# EAGLE design main (EAGLE 6.1)
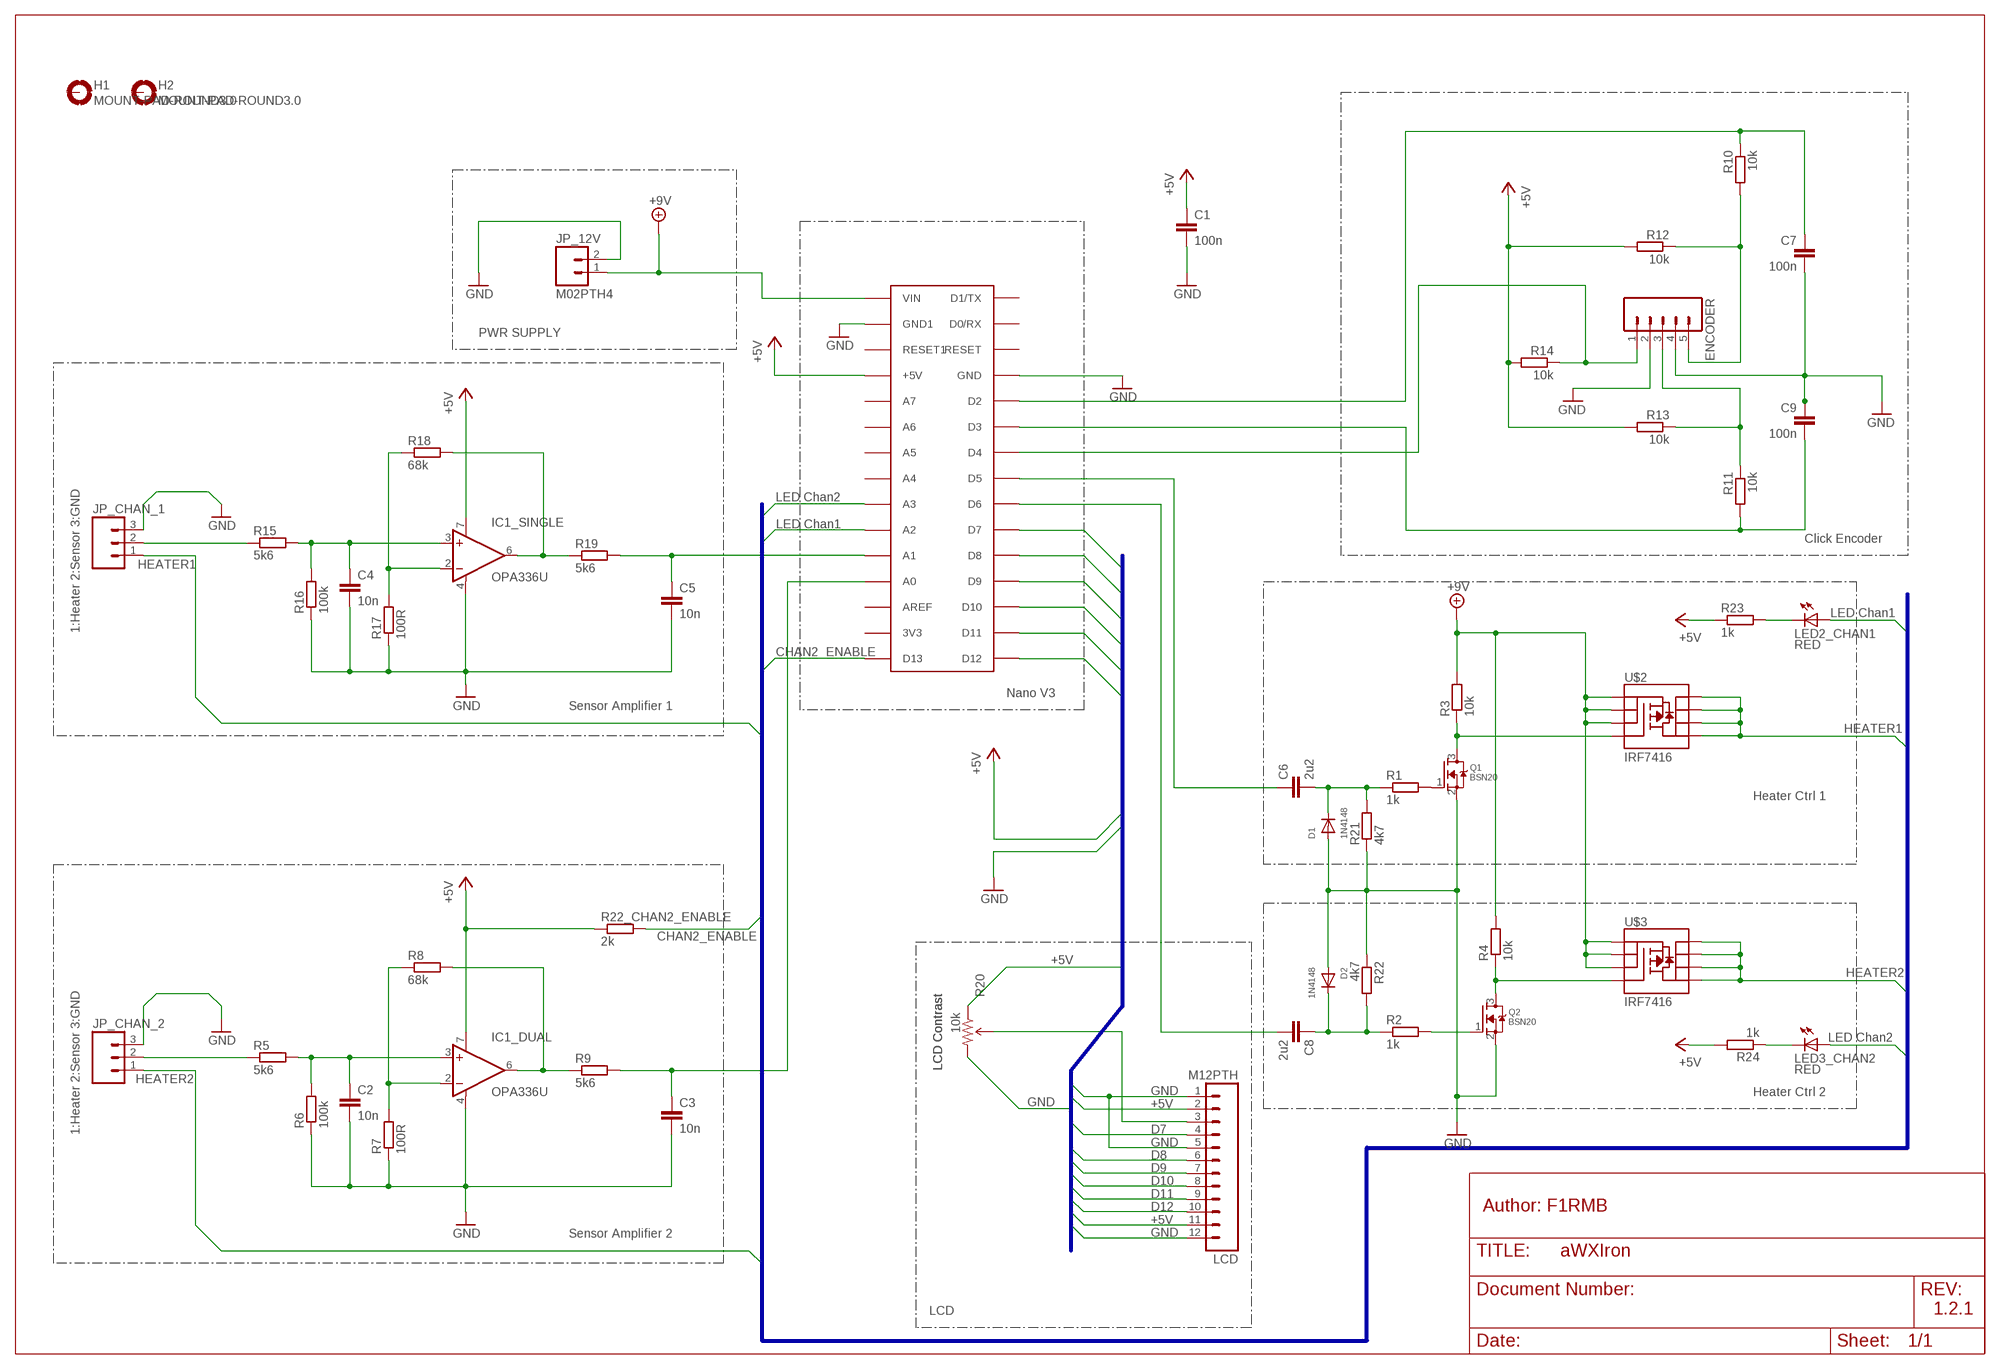
[diagram p0: schematic, sheet 1]
FRAME1 (DINA3_L): DRAWING_NAME: aWXIron

## Parts
C1  100n  C-EUC0805  [C0805]
C2  10n  C-EUC0805  [C0805]
C3  10n  C-EUC0805  [C0805]
C4  10n  C-EUC0805  [C0805]
C5  10n  C-EUC0805  [C0805]
C6  2u2  C-EUC0805  [C0805]
C7  100n  C-EUC0805  [C0805]
C8  2u2  C-EUC0805  [C0805]
C9  100n  C-EUC0805  [C0805]
D1  1N4148  DIODESOD-123  [SOD-123]
D2  1N4148  DIODESOD-123  [SOD-123]
ENCODER  M05PTH  [1X05]
H1  MOUNT-PAD-ROUND3.0  [3,0-PAD]
H2  MOUNT-PAD-ROUND3.0  [3,0-PAD]
IC1_DUAL  OPA336U  [SO08]
IC1_SINGLE  OPA336U  [SO08]
JP_12V  M02PTH4  [1X02_XTRA_BIG]
JP_CHAN_1  M03SCREW  [SCREWTERMINAL-3.5MM-3]
JP_CHAN_2  M03SCREW  [SCREWTERMINAL-3.5MM-3]
LCD  M12PTH  [1X12]
LED2_CHAN1  RED  LED3MM  [LED3MM]
LED3_CHAN2  RED  LED3MM  [LED3MM]
Q1  BSN20  MOSFET-NREFLOW  [SOT23]
Q2  BSN20  MOSFET-NREFLOW  [SOT23]
R1  1k  R-EU_R0805  [R0805]
R2  1k  R-EU_R0805  [R0805]
R3  10k  R-EU_R0805  [R0805]
R4  10k  R-EU_R0805  [R0805]
R5  5k6  R-EU_R0805  [R0805]
R6  100k  R-EU_R0805  [R0805]
R7  100R  R-EU_R0805  [R0805]
R8  68k  R-EU_R0805  [R0805]
R9  5k6  R-EU_R0805  [R0805]
R10  10k  R-EU_R0805  [R0805]
R11  10k  R-EU_R0805  [R0805]
R12  10k  R-EU_R0805  [R0805]
R13  10k  R-EU_R0805  [R0805]
R14  10k  R-EU_R0805  [R0805]
R15  5k6  R-EU_R0805  [R0805]
R16  100k  R-EU_R0805  [R0805]
R17  100R  R-EU_R0805  [R0805]
R18  68k  R-EU_R0805  [R0805]
R19  5k6  R-EU_R0805  [R0805]
R20  10k  TRIMPOT3362U-2  [3362U-2]
R21  4k7  R-EU_R0805  [R0805]
R22  4k7  R-EU_R0805  [R0805]
R22_CHAN2_ENABLE  2k  R-EU_R0805  [R0805]
R23  1k  R-EU_R0805  [R0805]
R24  1k  R-EU_R0805  [R0805]
U$1  ARDUINONANO  [PDIP-32]
U$2  IRF7416  MOSFET-PCHANNEL-SOIC8SOIC8  [SO08]
U$3  IRF7416  MOSFET-PCHANNEL-SOIC8SOIC8  [SO08]

## Nets
+5V: C1.1 IC1_DUAL.7(V+) IC1_SINGLE.7(V+) LCD.2 LCD.11 R12.2 R13.2 R14.2 R20.1(CCW) R22_CHAN2_ENABLE.1 R23.1 R24.2 U$1.+5V
+9V: JP_12V.1 R3.2 R4.2 U$1.VIN U$2.1(S) U$2.2(S) U$2.3(S) U$3.1(S) U$3.2(S) U$3.3(S)
DB4: LCD.7 U$1.D9
DB5: LCD.8 U$1.D10
DB6: LCD.9 U$1.D11
DB7: LCD.10 U$1.D12
E: LCD.6 U$1.D8
ENABLECHAN2: R22_CHAN2_ENABLE.2 U$1.D13
GND: C1.2 C2.2 C3.2 C4.2 C5.2 C7.2 C9.1 D1.A D2.A ENCODER.2 ENCODER.4 IC1_DUAL.4(V-) IC1_SINGLE.4(V-) JP_12V.2 JP_CHAN_1.3 JP_CHAN_2.3 LCD.1 LCD.5 LCD.12 Q1.2(S) Q2.2(S) R6.1 R7.1 R16.1 R17.1 R20.3(CW) R21.1 R22.1 U$1.GND U$1.GND1
HEATCHAN1: LED2_CHAN1.A U$1.A2
HEATCHAN2: LED3_CHAN2.A U$1.A3
HEATER1: JP_CHAN_1.1 U$2.5(D) U$2.6(D) U$2.7(D) U$2.8(D)
HEATER2: JP_CHAN_2.1 U$3.5(D) U$3.6(D) U$3.7(D) U$3.8(D)
N$1: Q1.3(D) R3.1 U$2.4(G)
N$2: Q2.3(D) R4.1 U$3.4(G)
N$3: JP_CHAN_2.2 R5.1
N$4: C2.1 IC1_DUAL.3(+IN) R5.2 R6.2
N$5: IC1_DUAL.2(-IN) R7.2 R8.1
N$6: C7.1 R10.1 U$1.D2
N$7: IC1_DUAL.6(OUT) R8.2 R9.1
N$8: JP_CHAN_1.2 R15.1
N$9: C4.1 IC1_SINGLE.3(+IN) R15.2 R16.2
N$10: C6.1 U$1.D5
N$11: C8.2 U$1.D6
N$12: Q1.1(G) R1.2
N$13: Q2.1(G) R2.2
N$14: C3.1 R9.2 U$1.A0
N$15: ENCODER.5 R10.2 R12.1
N$16: LCD.3 R20.2(WIPER)
N$17: C6.2 D1.C R1.1 R21.2
N$18: ENCODER.3 R11.1 R13.1
N$19: C9.2 R11.2 U$1.D3
N$20: IC1_SINGLE.2(-IN) R17.2 R18.1
N$21: IC1_SINGLE.6(OUT) R18.2 R19.1
N$22: ENCODER.1 R14.1 U$1.D4
N$23: C5.1 R19.2 U$1.A1
N$24: C8.1 D2.C R2.1 R22.2
N$27: LED2_CHAN1.K(C) R23.2
N$28: LED3_CHAN2.K(C) R24.1
RS: LCD.4 U$1.D7
Unconnected: H1.B3,0(MOUNT) H2.B3,0(MOUNT) U$1.3V3 U$1.A4 U$1.A5 U$1.A6 U$1.A7 U$1.AREF U$1.D0/RX U$1.D1/TX U$1.RESET U$1.RESET1

## Buses
+5V,GND,RS,E,DB4,DB5,DB6,DB7
HEATCHAN1,HEATCHAN2,ENABLECHAN2,HEATER1,HEATER2

## Notes on the sheet
- PWR SUPPLY
- LED Chan2
- LED Chan1
- Click Encoder
- HEATER1
- LED Chan1
- 1:Heater 2:Sensor 3:GND
- CHAN2_ENABLE
- Nano V3
- Sensor Amplifier 1
- HEATER1
- Heater Ctrl 1
- CHAN2_ENABLE
- +5V
- HEATER2
- LED Chan2
- LCD Contrast | LCD Contrast
- HEATER2
- GND | Heater Ctrl 2
- GND | +5V
- 1:Heater 2:Sensor 3:GND | D7
- GND
- D8
- D9
- D10
- D11
- D12 | Author: F1RMB
- +5V
- Sensor Amplifier 2 | GND
- LCD | 1.2.1

## Library data of the parts
C1-C9 = resistor:C-EU: CAPACITOR, European symbol
D1 D2 = adafruit:DIODE: Diode SMADIODE - SMA Surface Mount Package 20V 1A Schottky Diode Digikey: 641-1014-6-ND DO-1N4148 - Through Hole Small Current Diode SOD-123 20V 1 A (.5mV Vf) Schottky Diode - Digikey: MBRX120TPMSCT-ND SOD-323 10V 570mA (.38mV Vf, 3ns) Schottky Diode - Digikey: ZLLS410CT-ND SOD-523 30V 30mA Schottky Diode (RB751S-40TE61) - Digikey: RB751S-40TE61CT-ND SOT23-R/W - SOT23 Package (R = Solder Paste/Reflow Ovens, W = Hand-Soldering) BAT54Film 40V 300mA - Digikey: 497-7162-1-ND
ENCODER = SparkFun-Connectors:M05: Header 5 Standard 5-pin 0.1" header. Use with straight break away headers (SKU : PRT-00116), right angle break away headers (PRT-00553), swiss pins (PRT-00743), machine pins (PRT-00117), and female headers (PRT-00115). Molex polarized connector foot print use with SKU : PRT-08230 with associated crimp pins and housings.
H1 H2 = holes:MOUNT-PAD-ROUND: MOUNTING PAD, round
IC1_DUAL IC1_SINGLE = burr-brown:OPA336: CMOS Operational Amplifiers Single-Supply, MicroPower, MicroAmplifier(TM) Series; MF: TEXAS INSTRUMENT CONNECTORS; MPN: OPA336UA; OC_FARNELL: 1459587; OC_NEWARK: 35C1888
JP_12V = SparkFun-Connectors:M02: Standard 2-pin 0.1" header. Use with - straight break away headers ( PRT-00116) - right angle break away headers (PRT-00553) - swiss pins (PRT-00743) - machine pins (PRT-00117) - female headers (PRT-00115) Molex polarized connector foot print use with: PRT-08233 with associated crimp pins and housings. 2.54_SCREWTERM for use with PRT-10571. 3.5mm Screw Terminal footprints for PRT-08084 5mm Screw Terminal footprints for use with PRT-08433
JP_CHAN_1 JP_CHAN_2 = SparkFun-Connectors:M03: Header 3 Standard 3-pin 0.1" header. Use with straight break away headers (SKU : PRT-00116), right angle break away headers (PRT-00553), swiss pins (PRT-00743), machine pins (PRT-00117), and female headers (PRT-00115). Molex polarized connector foot print use with SKU : PRT-08232 with associated crimp pins and housings.
LCD = SparkFun-Connectors:M12: Header 12 Standard 12-pin 0.1" header. Use with straight break away headers (SKU : PRT-00116), right angle break away headers (PRT-00553), swiss pins (PRT-00743), machine pins (PRT-00117), and female headers (PRT-00115).
LED2_CHAN1 LED3_CHAN2 = SparkFun-LED:LED: LEDs Standard schematic elements and footprints for 5mm, 3mm, 1206, and 0603 sized LEDs. 5mm - Spark Fun Electronics SKU : COM-00529 (and others)
Q1 Q2 = adafruit:MOSFET-N: N-Channel Mosfet 2N7002E - 60V 260mA SOT23 [Digikey: 2N7002ET1GOSTR-ND] - REEL BSH103 - 30V 850mA SOT23 [Digikey: 568-5013-1-ND]
R1-R19 R21 R22 R22_CHAN2_ENABLE R23 R24 = resistor:R-EU_: RESISTOR, European symbol
R20 = SparkFun-Electromechanical:TRIMPOT: Various small potentiometers for "set-and-forget" applications
U$1 = jet-lib:ARDUINONANO
U$2 U$3 = SparkFun-DiscreteSemi:MOSFET-PCHANNEL-SOIC8: Generic 8-pin PMOSFET

## Board
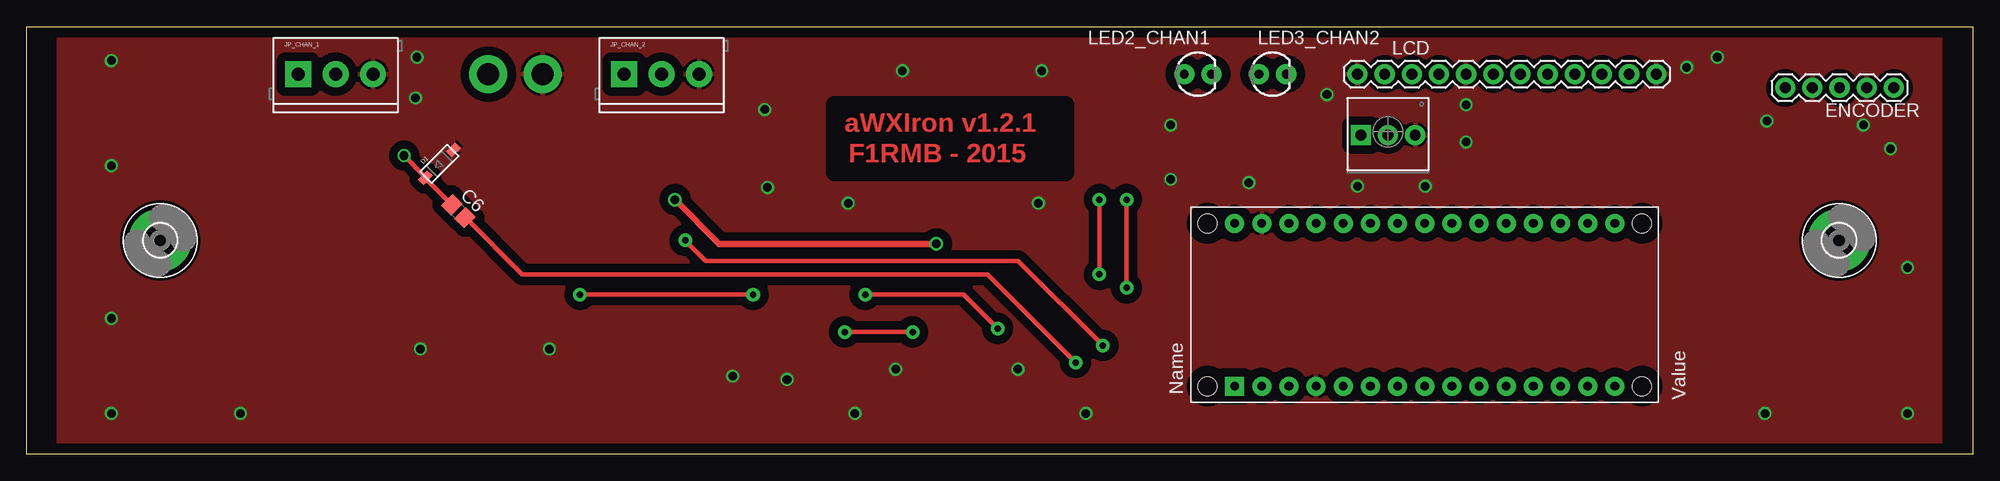
[diagram p1: board, top side]
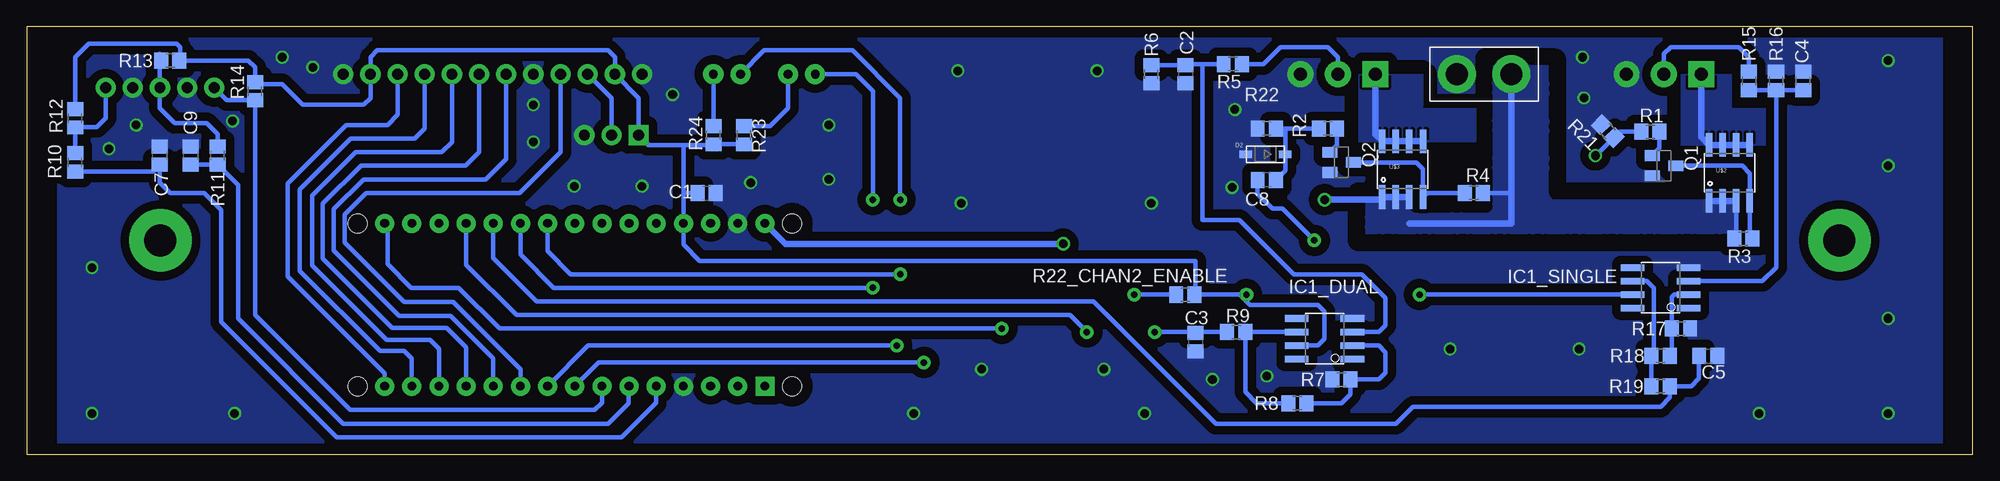
[diagram p2: board, bottom side, seen from below]

Size 181.98 x 40 mm. Coordinates in mm from the lower left corner, seen from the top.
Outline: 181.98,0 0,0 0,40 181.98,40 181.98,0
Copper layers (1*16): Top 0.035mm / dielectric 1.5mm / Bottom 0.035mm
Design rules: minimum track width 10mil, minimum drill 24mil, track to track 8mil, track to pad 8mil, pad to pad 8mil, via to via 8mil, smd to smd 8mil, copper to edge 40mil, drill to drill 8mil, minimum pad ring 10mil, minimum via ring 8mil, stop-mask expansion 4mil, vias tented up to drill 0mil, thermal gap 10mil
tRestrict: area 0,0 to 2,40; area 180,0 to 182,40; area 75.5,26.4 to 97.1,32.7
bRestrict: area 0,0 to 2,40; area 180,0 to 182,40; 114 lines

### Footprints (pad centres in the part's own frame; a part is rotated, then mirrored left to right if it is on the bottom)
C0805 = smd 1.3 x 1.5: 1 -0.85,0; 2 0.85,0
SOD-123 = smd 1.2 x 0.7: A 1.85,0; C -1.85,0
1X05 = drill 1.016 pad 1.88: 1 0,0; 2 2.54,0; 3 5.08,0; 4 7.62,0; 5 10.16,0
3,0-PAD = drill 3 pad 5.842: B3,0 0,0
SO08 = smd 0.61 x 2.21: 1 -1.905,-2.616; 2 -0.635,-2.616; 3 0.635,-2.616; 4 1.905,-2.616; 5 1.905,2.616; 6 0.635,2.616; 7 -0.635,2.616; 8 -1.905,2.616
1X02_XTRA_BIG = drill 2.057 pad 3.556: 1 -2.54,0; 2 2.54,0
SCREWTERMINAL-3.5MM-3 = drill 1.2 pad 2.413 square: 1 0,0 | drill 1.2 pad 2.413: 2 3.5,0; 3 7,0
1X12 = drill 1.016 pad 1.88: 1 0,0; 2 2.54,0; 3 5.08,0; 4 7.62,0; 5 10.16,0; 6 12.7,0; 7 15.24,0; 8 17.78,0; 9 20.32,0; 10 22.86,0; 11 25.4,0; 12 27.94,0
LED3MM = drill 0.813 pad 1.88: A -1.27,0; K 1.27,0
SOT23 = smd 1 x 1.4: 1 -0.95,-1.1; 2 0.95,-1.1; 3 0,1.1
R0805 = smd 1.3 x 1.5: 1 -0.85,0; 2 0.85,0
3362U-2 = drill 1.016 pad 1.88 square: 1 -2.54,-0.305 | drill 1.016 pad 1.88: 2 0,-0.305; 3 2.54,-0.305
PDIP-32 = drill 0.8 pad 1.778: 3V3 15.24,-35.56; +5V 15.24,-10.16; A0 15.24,-30.48; A1 15.24,-27.94; A2 15.24,-25.4; A3 15.24,-22.86; A4 15.24,-20.32; A5 15.24,-17.78; A6 15.24,-15.24; A7 15.24,-12.7; AREF 15.24,-33.02; D0/RX 0,-5.08; D2 0,-12.7; D3 0,-15.24; D4 0,-17.78; D5 0,-20.32; D6 0,-22.86; D7 0,-25.4; D8 0,-27.94; D9 0,-30.48; D10 0,-33.02; D11 0,-35.56; D12 0,-38.1; D13 15.24,-38.1; GND 0,-10.16; GND1 15.24,-5.08; RESET 0,-7.62; RESET1 15.24,-7.62; VIN 15.24,-2.54 | drill 0.8 pad 1.778 square: D1/TX 0,-2.54 | hole 1.778: 0,0; 0,-40.64; 15.24,-40.64; 15.24,0

### Placement (x,y rotation side)
C1  118.41,24.45 0 bottom
C2  73.64,35.56 270 bottom
C3  72.69,10.48 270 bottom
C4  15.86,34.92 90 bottom
C5  24.75,9.21 0 bottom
C6  40.37,22.73 135 top
C7  169.52,27.94 90 bottom
C8  66.02,25.65 180 bottom
C9  166.67,27.94 270 bottom
D1  38.59,27.18 45 top
D2  66.15,28.07 180 bottom
ENCODER  164.44,34.29 0 top
H1  169.48,20 0 top
H2  12.48,20 0 top
IC1_DUAL  60.62,10.79 90 bottom
IC1_SINGLE  29.19,15.56 90 bottom
JP_12V  45.7,35.56 180 bottom
JP_CHAN_1  25.38,35.56 0 top
JP_CHAN_2  55.86,35.56 0 top
LCD  124.44,35.56 0 top
LED2_CHAN1  109.52,35.56 0 top
LED3_CHAN2  116.5,35.56 0 top
Q1  28.87,26.99 270 bottom
Q2  59.03,27.3 270 bottom
R1  30.14,30.16 0 bottom
R2  60.3,30.48 0 bottom
R3  21.46,20.17 180 bottom
R4  46.65,24.45 0 bottom
R5  69.2,36.51 180 bottom
R6  76.81,35.56 90 bottom
R7  59.03,6.99 0 bottom
R8  63.16,4.76 180 bottom
R9  68.88,11.43 180 bottom
R10  177.46,27.3 90 bottom
R11  164.13,27.94 270 bottom
R12  177.46,31.43 90 bottom
R13  168.57,36.83 0 bottom
R14  160.63,33.97 90 bottom
R15  20.93,34.92 270 bottom
R16  18.39,34.92 270 bottom
R17  27.29,11.75 180 bottom
R18  29.19,9.21 180 bottom
R19  29.19,6.35 0 bottom
R20  127.3,30.16 0 top
R21  34.14,30.23 315 bottom
R22  66.02,30.48 0 bottom
R22_CHAN2_ENABLE  73.64,14.92 180 bottom
R23  114.92,29.84 90 bottom
R24  117.77,29.84 270 bottom
U$1  110.41,6.35 90 top
U$2  22.76,26.32 0 bottom
U$3  53.32,26.67 0 bottom

### Tracks (layer width: path | path; a pad name or v marks a point on that pad's centre or on a via)
+5V  (via drill 0.6 pad 1.27)
  Top 0.406: v51.73,14.92 v67.92,14.92
  Bottom 0.406: U$1.+5V 120.57,28.94 | 120.57,28.94 117.83,28.94 R24.2 R23.1 | U$1.+5V 120.57,19.63 119.04,18.1 72.69,18.1 72.69,14.82 R22_CHAN2_ENABLE.1 68.56,14.92 | R12.2 177.46,37.15 176.19,38.42 167.94,38.42 167.62,38.1 167.62,37.57 R13.2 161.27,36.83 160.63,36.2 R14.2 160.42,34.61 158.09,34.61 156.19,32.7 150.47,32.7 149.84,33.34 LCD.11 149.84,37.15 149.2,37.78 127.62,37.78 126.98,37.15 LCD.2 124.76,33.34 R20.1 123.9,29 123.9,28.94 120.57,28.94 | IC1_SINGLE.7 v51.73,14.92 | v67.92,14.92 68.56,14.92 | IC1_DUAL.7 61.26,10.16 60.62,10.79 60.62,13.34 61.26,13.97 67.61,13.97 68.56,14.92 | C1.1 120.57,24.45 U$1.+5V
+9V  (via drill 0.8 pad 1.27)
  Top 0.61: v60.62,23.81 64.75,19.68 v85.07,19.68
  Bottom 0.406: R3.2 arc-90 22.13,19.71 U$2.3 | 49.19,21.59 50.14,21.59 | R4.2 43.16,24.45
  Bottom 0.61: U$3.3 U$3.2 U$3.1 | U$2.1 U$2.2 U$2.3 | JP_12V.1 43.16,24.51 43.16,24.45 43.16,21.59 50.14,21.59 52.68,21.59 | U$1.VIN 111.04,19.68 v85.07,19.68 | 55.47,23.81 v60.62,23.81
  pour Bottom (isolate 0.406, no thermals): 39.22,36.7 45.19,36.7 45.32,22.86 52.68,22.86 52.68,24.13 57.13,24.13 57.13,20.32 22.21,20.32 22.21,23.81 39.35,23.81
DB4
  Bottom 0.406: LCD.7 139.68,28.26 140.95,26.99 150.73,26.99 154.28,23.43 154.28,18.29 147.81,11.81 142.73,11.81 140.89,9.97 U$1.D9
DB5
  Bottom 0.406: LCD.8 142.22,29.21 143.17,28.26 151.24,28.26 155.3,24.19 155.3,17.65 148.32,10.67 144.25,10.67 143.43,9.85 U$1.D10
DB6
  Bottom 0.406: LCD.9 144.76,30.48 145.71,29.53 151.68,29.53 156.44,24.77 156.44,17.14 148.95,9.65 146.66,9.65 145.97,8.96 U$1.D11
DB7
  Bottom 0.406: LCD.10 147.3,31.75 148.25,30.8 152.13,30.8 157.59,25.34 157.59,16.64 148.51,7.56 U$1.D12
E
  Bottom 0.406: LCD.6 137.14,27.62 139.04,25.72 150.47,25.72 153.27,22.92 153.27,19.05 147.17,12.95 142.35,12.95 138.35,8.96 U$1.D8
ENABLECHAN2  (via drill 0.6 pad 1.27)
  Top 0.406: v78.4,14.92 87.61,14.92 v90.79,11.75
  Bottom 0.406: v90.79,11.75 137.77,11.75 141.58,15.56 146.03,15.56 148.25,17.78 148.25,20.95 148.51,21.21 U$1.D13 | R22_CHAN2_ENABLE.2 v78.4,14.92
GND  (via drill 0.8)
  other vias: 69,32.26 106.98,30.8 36.49,37.15 7.92,12.7 36.81,9.84 77.45,3.81 69.26,24.96 71.1,6.99 66.02,7.3 162.54,3.81 175.88,3.81 134.6,32.7 48.88,9.84 7.92,3.81 7.92,36.83 158.09,37.15 174.29,28.57 76.81,23.5 99.04,3.81 124.44,25.08 94.59,23.5 114.28,25.4 36.37,33.34 171.75,30.8 155.24,36.2 134.6,29.21 130.79,25.08 106.98,25.72 94.91,35.88 81.9,35.88 81.26,7.94 92.69,7.94 175.88,17.46 7.92,26.99 19.98,3.81 121.58,33.66 162.73,31.18
  pour Bottom (isolate 0.813, no thermals): -1.93,41.59 184.45,41.59 184.45,-1.91 -1.93,-1.91
  pour Top (isolate 0.813): -1.93,41.91 184.76,41.91 184.76,-2.22 -1.93,-2.22
HEATCHAN1  (via drill 0.6 pad 1.27)
  Top 0.406: v102.85,15.56 v102.85,23.81
  Bottom 0.406: v102.85,15.56 132.69,15.56 135.81,18.67 U$1.A2 | v102.85,23.81 102.85,33.97 104.44,35.56 LED2_CHAN1.A
HEATCHAN2  (via drill 0.6 pad 1.27)
  Top 0.406: v100.31,23.81 v100.31,16.83
  Bottom 0.406: v100.31,16.83 127.62,16.83 128.5,16.83 131.11,16.83 133.27,18.99 U$1.A3 | LED3_CHAN2.A 113.01,37.78 104.76,37.78 100.31,33.34 v100.31,23.81
HEATER1
  Bottom 0.61: JP_CHAN_1.1 25.38,29.65 U$2.8 U$2.7 U$2.6 U$2.5
  pour Bottom: 24.43,35.56 22.52,35.56 22.52,32.38 19.35,32.38 19.35,28.89 27.29,28.89 27.29,35.56
HEATER2
  Bottom 0.61: JP_CHAN_2.1 55.86,29.92 U$3.8 U$3.7 U$3.6 U$3.5
  pour Bottom: 51.41,35.56 57.45,35.56 57.45,29.21 46.46,29.21 46.46,32.38 51.41,32.38
N$1
  Bottom 0.406: R3.1 arc90 20.86,19.79 U$2.4 20.86,26.28 21.57,26.99 Q1.3
N$2
  Bottom 0.406: R4.1 51.02,24.45 U$3.4 51.41,26.67 52.05,27.3 Q2.3
N$3
  Bottom 0.406: JP_CHAN_2.2 59.36,37.16 60.3,38.1 64.75,38.1 66.34,36.51 R5.1
N$4
  Bottom 0.406: R5.2 72.05,36.51 | R6.2 C2.1 73.54,36.51 72.24,36.51 72.05,36.51 | IC1_DUAL.3 55.54,11.43 54.91,12.06 54.91,14.61 57.13,16.83 63.48,16.83 68.56,21.91 72.05,21.91 72.05,36.51
N$5
  Bottom 0.406: IC1_DUAL.2 55.54,10.16 54.91,9.53 54.91,7.62 55.54,6.99 R7.2 58.18,5.61 59.03,4.76 R8.1
N$6
  Bottom 0.406: R10.1 170.16,26.45 C7.1 169.52,25.4 168.57,24.45 165.4,24.45 163.81,22.86 163.81,12.38 153.01,1.59 126.34,1.59 123.11,4.82 U$1.D2
N$7
  Bottom 0.406: IC1_DUAL.6 R9.1 68.03,5.82 66.97,4.76 R8.2
N$8
  Bottom 0.406: JP_CHAN_1.2 28.88,37.47 28.87,37.47 28.24,38.1 21.89,38.1 20.93,37.15 R15.1
N$9
  Bottom 0.406: C4.1 R16.2 | R16.2 R15.2 | IC1_SINGLE.3 19.66,16.19 18.39,17.46 R16.2
N$10  (via drill 0.6 pad 1.27)
  Top 0.406: v98.09,8.57 89.83,16.83 46.33,16.83 41.03,22.13 C6.1
  Bottom 0.406: U$1.D5 128.51,8.57 v98.09,8.57
N$11  (via drill 0.6 pad 1.27)
  Top 0.406: v61.57,20 63.48,18.1 92.69,18.1 v100.63,10.16
  Bottom 0.406: U$1.D6 129.47,10.16 v100.63,10.16 | C8.2 66.87,24.34 65.51,22.99 64.56,22.99 v61.57,20
N$12
  Bottom 0.406: Q1.1 29.29,28.62 R1.2
N$13
  Bottom 0.406: Q2.1 59.45,28.93 R2.2
N$14  (via drill 0.6 pad 1.27)
  Top 0.406: v82.85,11.43 v76.5,11.43
  Bottom 0.406: U$1.A0 140.89,17.72 136.19,13.02 84.44,13.02 v82.85,11.43 | v76.5,11.43 72.79,11.43 C3.1 72.59,11.43 R9.2
N$15
  Bottom 0.406: R10.2 R12.1 175.45,30.58 174.6,31.43 ENCODER.5
N$16
  Bottom 0.406: LCD.3 127.3,33.34 R20.2
N$17  (via drill 0.8)
  Top 0.406: C6.2 37.28,25.82 D1.C 37.28,25.95 v35.29,27.94
  Bottom 0.406: 31.28,29.88 R1.1 33,30.16 R21.2 35.23,27.94 v35.29,27.94
N$18
  Bottom 0.406: R13.1 169.52,37.47 ENCODER.3 169.52,32.38 168.13,30.99 165.14,30.99 164.13,29.97 R11.1
N$19
  Bottom 0.406: C9.2 R11.2 162.22,25.18 162.22,12.7 152.38,2.86 127.62,2.86 125.71,4.76 125.71,6.35 125.7,6.36 U$1.D3
N$20
  Bottom 0.406: R18.1 28.14,9.41 R17.2 28.14,14.71 27.92,14.92 IC1_SINGLE.2
N$21
  Bottom 0.406: R19.1 R18.2 29.82,9.42 29.82,12.7 29.82,13.02 29.82,15.56 30.46,16.19 IC1_SINGLE.6
N$22
  Bottom 0.406: ENCODER.1 163.28,33.12 R14.1 160.63,13.02 151.74,4.13 128.88,4.13 128.19,4.82 U$1.D4
N$23
  Bottom 0.406: C5.1 25.59,7.09 26.33,6.35 R19.2 28.34,5.29 29.19,4.45 52.37,4.45 53.95,2.86 70.78,2.86 82.21,14.29 134.28,14.29 138.35,18.36 U$1.A1
N$24
  Bottom 0.406: C8.1 64.3,26.53 D2.C 64.3,30.48 R22.2 R2.1
N$27
  Bottom 0.406: LED2_CHAN1.K 110.79,32.38 112.48,30.7 R23.2
N$28
  Bottom 0.406: LED3_CHAN2.K R24.1
RS
  Bottom 0.406: LCD.4 132.06,28.26 135.87,24.45 150.22,24.45 152.25,22.42 152.25,19.81 146.66,14.22 142.09,14.22 135.81,7.94 U$1.D7

### Text on the board
Top: aWXIron v1.2.1 | F1RMB - 2015